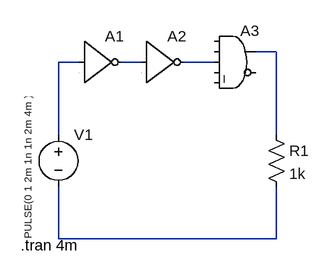
[diagram p0: schematic 301.asc]
301.asc, the LTspice schematic file:
Version 4
SHEET 1 880 680
WIRE 384 64 352 64
WIRE 80 80 48 80
WIRE 176 80 144 80
WIRE 288 80 240 80
WIRE 48 192 48 80
WIRE 384 192 384 64
WIRE 48 352 48 272
WIRE 384 352 384 272
WIRE 384 352 48 352
SYMBOL voltage 48 176 R0
WINDOW 3 -47 176 VLeft 1
SYMATTR InstName V1
SYMATTR Value PULSE(0 1 2m 1n 1n 2m 4m )
SYMBOL res 368 176 R0
SYMATTR InstName R1
SYMATTR Value 1k
SYMBOL Digital\\inv 80 16 R0
SYMATTR InstName A1
SYMBOL Digital\\inv 176 16 R0
SYMATTR InstName A2
SYMBOL Digital\\and 320 16 R0
SYMATTR InstName A3
TEXT -10 362 Left 2 !.tran 4m

The netlist it stands for:
* 301.asc
V1 N002 N005 PULSE(0 1 2m 1n 1n 2m 4m )
R1 N001 N005 1k
A1 N002 0 0 0 0 N003 0 0 BUF
A2 N003 0 0 0 0 N004 0 0 BUF
A3 0 0 N004 0 0 0 N001 0 AND
.tran 4m
.backanno
.end